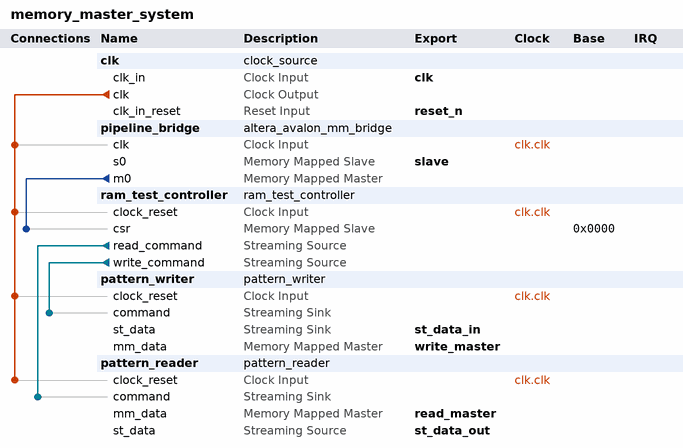
[diagram p0: system contents]
# Platform Designer (Qsys) system memory_master_system
# Parameters at their usual value, and those the tool derives, are not listed.
package require -exact qsys 10.1
create_system memory_master_system
set_project_property DEVICE_FAMILY CYCLONEIII

add_instance clk clock_source 10.1
set_instance_parameter_value clk clockFrequency 50000000
set_instance_parameter_value clk clockFrequencyKnown false

add_instance pipeline_bridge altera_avalon_mm_bridge 10.1
set_instance_parameter_value pipeline_bridge DATA_WIDTH 32
set_instance_parameter_value pipeline_bridge ADDRESS_WIDTH 5
set_instance_parameter_value pipeline_bridge ADDRESS_UNITS SYMBOLS
set_instance_parameter_value pipeline_bridge BURSTCOUNT_UNITS SYMBOLS
set_instance_parameter_value pipeline_bridge MAX_PENDING_RESPONSES 1

add_instance ram_test_controller ram_test_controller 1.0
set_instance_parameter_value ram_test_controller DEFAULT_TIMER_RESOLUTION 10
set_instance_parameter_value ram_test_controller DEFAULT_BLOCK_SIZE 1024
set_instance_parameter_value ram_test_controller DEFAULT_TRAIL_DISTANCE 1
set_instance_parameter_value ram_test_controller CLOCK_SPEED 0

add_instance pattern_writer pattern_writer 1.0
set_instance_parameter_value pattern_writer ADDRESS_WIDTH 32
set_instance_parameter_value pattern_writer LENGTH_WIDTH 21
set_instance_parameter_value pattern_writer DATA_WIDTH 32
set_instance_parameter_value pattern_writer FIFO_DEPTH 128
set_instance_parameter_value pattern_writer BURST_ENABLE 1
set_instance_parameter_value pattern_writer MAX_BURST_COUNT 2
set_instance_parameter_value pattern_writer BURST_REALIGN_ENABLE 1

add_instance pattern_reader pattern_reader 1.0
set_instance_parameter_value pattern_reader ADDRESS_WIDTH 32
set_instance_parameter_value pattern_reader LENGTH_WIDTH 21
set_instance_parameter_value pattern_reader DATA_WIDTH 32
set_instance_parameter_value pattern_reader FIFO_DEPTH 128
set_instance_parameter_value pattern_reader BURST_ENABLE 1
set_instance_parameter_value pattern_reader MAX_BURST_COUNT 2
set_instance_parameter_value pattern_reader BURST_REALIGN_ENABLE 1

# connections
add_connection clk.clk pattern_reader.clock_reset clock
add_connection clk.clk pattern_writer.clock_reset clock
add_connection clk.clk pipeline_bridge.clk clock
add_connection clk.clk ram_test_controller.clock_reset clock
add_connection pipeline_bridge.m0 ram_test_controller.csr avalon
set_connection_parameter_value pipeline_bridge.m0/ram_test_controller.csr baseAddress 0x0000
add_connection ram_test_controller.read_command pattern_reader.command avalon_streaming
add_connection ram_test_controller.write_command pattern_writer.command avalon_streaming

# exported interfaces
add_interface clk clock sink
set_interface_property clk EXPORT_OF clk.clk_in
add_interface reset_n reset sink
set_interface_property reset_n EXPORT_OF clk.clk_in_reset
add_interface write_master avalon master
set_interface_property write_master EXPORT_OF pattern_writer.mm_data
add_interface read_master avalon master
set_interface_property read_master EXPORT_OF pattern_reader.mm_data
add_interface st_data_in avalon_streaming sink
set_interface_property st_data_in EXPORT_OF pattern_writer.st_data
add_interface st_data_out avalon_streaming source
set_interface_property st_data_out EXPORT_OF pattern_reader.st_data
add_interface slave avalon slave
set_interface_property slave EXPORT_OF pipeline_bridge.s0

save_system memory_master_system.qsys
